# EAGLE schematic pedometer (EAGLE 5.04)
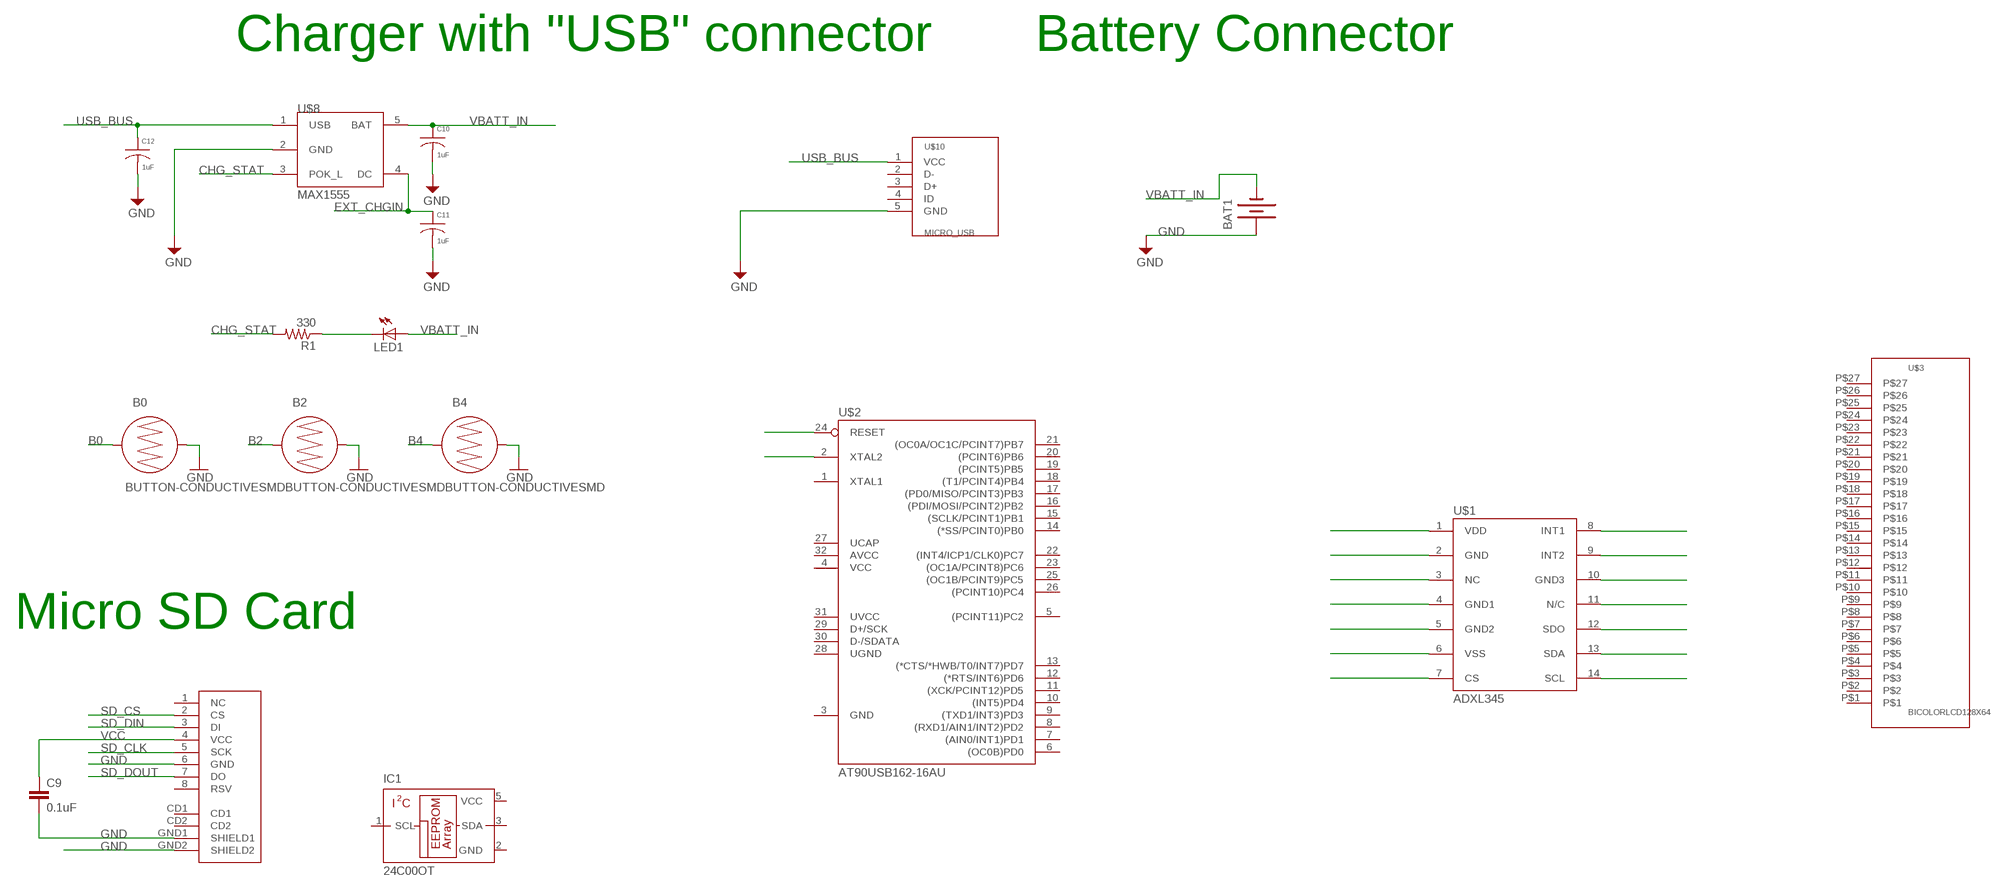
[diagram p0: schematic, sheet 1]

## Parts
B0  BUTTON-CONDUCTIVESMD  [BUTTON-CONDUCTIVE]
B2  BUTTON-CONDUCTIVESMD  [BUTTON-CONDUCTIVE]
B4  BUTTON-CONDUCTIVESMD  [BUTTON-CONDUCTIVE]
BAT1  BATTERY20MM_FOB  [FOB_20MM_BAT]
C9  0.1uF  C-EUC0603  [C0603]
C10  1uF  C0603  [C0603]
C11  1uF  C0603  [C0603]
C12  1uF  C0603  [C0603]
IC1  24C00OT  [SOT23-5L]
LED1  LEDSMT1206  [1206]
R1  330  R-US_R0402  [R0402]
U$1  ADXL345  [LGA14]
U$2  AT90USB162-16AU  [VQFP32]
U$3  BICOLORLCD128X64  [BICOLOR_OLED128X64]
U$8  MAX1555  [SOT23-5L]
U$10  MICRO_USB  [MICRO_USB]
U$12  USD-SOCKETUSD  [USD-SOCKET-PP]

## Nets
B0: B0.1
B2: B2.1
B4: B4.1
CHG_STAT: R1.2 U$8.3(POK_L)
EXT_CHGIN: C11.1 U$8.4(DC)
GND: B0.2 B2.2 B4.2 BAT1.POS1(+) C9.2 C10.2 C11.2 C12.2 U$8.2(GND) U$10.5(GND) U$12.6(GND) U$12.GND1(SHIELD1) U$12.GND2(SHIELD2)
N$1: U$1.1(VDD)
N$2: U$1.2(GND)
N$3: U$1.3(NC)
N$4: U$1.4(GND1)
N$5: U$1.5(GND2)
N$6: U$1.6(VSS)
N$7: U$1.7(CS)
N$8: U$1.8(INT1)
N$9: U$1.9(INT2)
N$10: U$1.10(GND3)
N$11: U$1.11(N/C)
N$12: U$1.12(SDO)
N$13: U$1.13(SDA)
N$14: U$1.14(SCL)
N$15: U$2.24(RESET)
N$16: LED1.C R1.1
N$17: U$2.2(XTAL2)
SD_CLK: U$12.5(SCK)
SD_CS: U$12.2(CS)
SD_DIN: U$12.3(DI)
SD_DOUT: U$12.7(DO)
USB_BUS: C12.1 U$8.1(USB) U$10.1(VCC)
VBATT_IN: BAT1.NEG(-) C10.1 LED1.A U$8.5(BAT)
VCC: C9.1 U$12.4(VCC)
Unconnected: IC1.1(SCL) IC1.3(SDA) U$2.1(XTAL1) U$2.5((PCINT11)PC2) U$2.6((OC0B)PD0) U$2.7((AIN0/INT1)PD1) U$2.8((RXD1/AIN1/INT2)PD2) U$2.9((TXD1/INT3)PD3) U$2.10((INT5)PD4) U$2.11((XCK/PCINT12)PD5) U$2.12((*RTS/INT6)PD6) U$2.13((*CTS/*HWB/T0/INT7)PD7) U$2.14((*SS/PCINT0)PB0) U$2.15((SCLK/PCINT1)PB1) U$2.16((PDI/MOSI/PCINT2)PB2) U$2.17((PD0/MISO/PCINT3)PB3) U$2.18((T1/PCINT4)PB4) U$2.19((PCINT5)PB5) U$2.20((PCINT6)PB6) U$2.21((OC0A/OC1C/PCINT7)PB7) U$2.22((INT4/ICP1/CLK0)PC7) U$2.23((OC1A/PCINT8)PC6) U$2.25((OC1B/PCINT9)PC5) U$2.26((PCINT10)PC4) U$2.29(D+/SCK) U$2.30(D-/SDATA) U$3.P$1 U$3.P$2 U$3.P$3 U$3.P$4 U$3.P$5 U$3.P$6 U$3.P$7 U$3.P$8 U$3.P$9 U$3.P$10 U$3.P$11 U$3.P$12 U$3.P$13 U$3.P$14 U$3.P$15 U$3.P$16 U$3.P$17 U$3.P$18 U$3.P$19 U$3.P$20 U$3.P$21 U$3.P$22 U$3.P$23 U$3.P$24 U$3.P$25 U$3.P$26 U$3.P$27 U$10.2(D-) U$10.3(D+) U$10.4(ID) U$12.1(NC) U$12.8(RSV) U$12.CD1 U$12.CD2

## Notes on the sheet
- Charger with "USB" connector | Battery Connector
- Micro SD Card

## Power pins joined to a net without a drawn wire
AVCC: U$2.32(AVCC)
GND: IC1.2(GND) U$2.3(GND)
UCAP: U$2.27(UCAP)
UGND: U$2.28(UGND)
UVCC: U$2.31(UVCC)
VCC: IC1.5(VCC) U$2.4(VCC)

## Library data of the parts
B0 B2 B4 = SparkFun:BUTTON-CONDUCTIVE: Conductive Button Used with rubber key pads. This one was designed and proven to work with the PolyCase Key FOB enclosures.
BAT1 = SparkFun:BATTERY: Battery Holders Various common sizes : AA, AAA, 20mm coin cell and 12mm coin cell.
C9 = rcl:C-EU: CAPACITOR, European symbol
C10-C12 = qualified_1:C
IC1 = microchip:24C0*: Serial EEPROM 128 bit/1 K/2 K, I2C
LED1 = led:LED: LED OSRAM: - CHIPLED LG R971, LG N971, LY N971, LG Q971, LY Q971, LO R971, LY R971 LH N974, LH R974 LS Q976, LO Q976, LY Q976 LO Q996 - Hyper CHIPLED LW Q18S LB Q993, LB Q99A, LB R99A - SideLED LS A670, LO A670, LY A670, LG A670, LP A670 LB A673, LV A673, LT A673, LW A673 LH A674 LY A675 LS A676, LA A676, LO A676, LY A676, LW A676 LS A679, LY A679, LG A679 - Hyper Micro SIDELED® LS Y876, LA Y876, LO Y876, LY Y876 LT Y87S - SmartLED LW L88C, LW L88S LB L89C, LB L89S, LG L890 LS L89K, LO L89K, LY L89K LS L896, LA L896, LO L896, LY L896 - TOPLED LS T670, LO T670, LY T670, LG T670, LP T670 LSG T670, LSP T670, LSY T670, LOP T670, LYG T670 LG T671, LOG T671, LSG T671 LB T673, LV T673, LT T673, LW T673 LH T674 LS T676, LA T676, LO T676, LY T676, LB T676, LH T676, LSB T676, LW T676 LB T67C, LV T67C, LT T67C, LS T67K, LO T67K, LY T67K, LW E67C LS E67B, LA E67B, LO E67B, LY E67B, LB E67C, LV E67C, LT E67C LW T67C LS T679, LY T679, LG T679 LS T770, LO T770, LY T770, LG T770, LP T770 LB T773, LV T773, LT T773, LW T773 LH T774 LS E675, LA E675, LY E675, LS T675 LS T776, LA T776, LO T776, LY T776, LB T776 LHGB T686 LT T68C, LB T68C - Hyper Mini TOPLED® LB M676 - Mini TOPLED Santana® LG M470 LS M47K, LO M47K, LY M47K Source: http://www.osram.convergy.de - LUMILED® LXK2-PW12-R00, LXK2-PW12-S00, LXK2-PW14-U00, LXK2-PW14-V00 LXK2-PM12-R00, LXK2-PM12-S00, LXK2-PM14-U00 LXK2-PE12-Q00, LXK2-PE12-R00, LXK2-PE12-S00, LXK2-PE14-T00, LXK2-PE14-U00 LXK2-PB12-K00, LXK2-PB12-L00, LXK2-PB12-M00, LXK2-PB14-N00, LXK2-PB14-P00, LXK2-PB14-Q00 LXK2-PR12-L00, LXK2-PR12-M00, LXK2-PR14-Q00, LXK2-PR14-R00 LXK2-PD12-Q00, LXK2-PD12-R00, LXK2-PD12-S00 LXK2-PH12-R00, LXK2-PH12-S00 LXK2-PL12-P00, LXK2-PL12-Q00, LXK2-PL12-R00 Source: www.luxeon.com
R1 = rcl:R-US_: RESISTOR, American symbol
U$1 = SparkFun:ADXL345
U$2 = at90usb:AT90USB162
U$3 = m-pad-2.1:BICOLORLCD128X64
U$8 = m-pad-2.0:MAX1555
U$10 = camera_project:MICRO_USB
U$12 = SparkFun-3-2-07:USD-SOCKET: microSD Socket Push-push type uSD socket. Schematic element and footprint production proven. Spark Fun Electronics SKU : PType-microSD. tDoc lines correctly indicate media card edge positions when inserting (unlocked, locked, depressed).